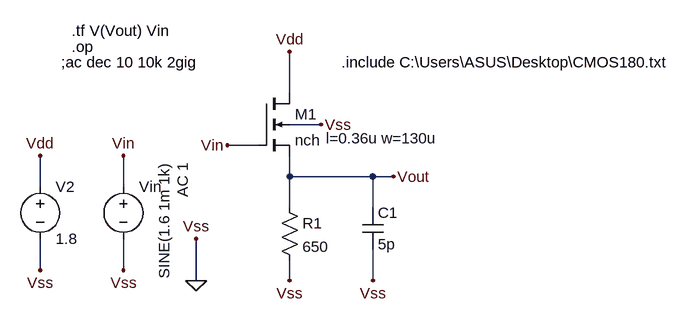
[diagram p0: schematic Common drain.asc]
Common drain.asc, the LTspice schematic file:
Version 4
SHEET 1 884 680
WIRE 304 64 304 0
WIRE 352 112 304 112
WIRE 256 144 208 144
WIRE 304 192 304 160
WIRE 432 192 304 192
WIRE 464 192 432 192
WIRE -80 208 -80 160
WIRE 48 208 48 160
WIRE 304 240 304 192
WIRE 432 240 432 192
WIRE -80 336 -80 288
WIRE 48 336 48 288
WIRE 160 352 160 288
WIRE 304 352 304 320
WIRE 432 352 432 304
FLAG 304 0 Vdd
FLAG 208 144 Vin
FLAG 464 192 Vout
FLAG 352 112 Vss
FLAG 304 352 Vss
FLAG 432 352 Vss
FLAG 48 336 Vss
FLAG -80 336 Vss
FLAG -80 160 Vdd
FLAG 48 160 Vin
FLAG 160 352 0
FLAG 160 288 Vss
DATAFLAG 304 192 ""
DATAFLAG 304 192 ""
DATAFLAG 304 192 ""
DATAFLAG 304 192 ""
SYMBOL nmos4 256 64 R0
WINDOW 123 104 69 Left 2
SYMATTR Value2 l=0.36u w=130u
SYMATTR InstName M1
SYMATTR Value nch
SYMBOL res 288 224 R0
SYMATTR InstName R1
SYMATTR Value 650
SYMBOL cap 416 240 R0
SYMATTR InstName C1
SYMATTR Value 5p
SYMBOL voltage 48 192 R0
WINDOW 3 63 -21 VRight 2
WINDOW 123 91 -21 VRight 2
WINDOW 39 0 0 Left 0
SYMATTR Value SINE(1.6 1m 1k)
SYMATTR Value2 AC 1
SYMATTR InstName Vin
SYMBOL voltage -80 192 R0
WINDOW 123 0 0 Left 0
WINDOW 39 0 0 Left 0
SYMATTR InstName V2
SYMATTR Value 1.8
TEXT 384 16 Left 2 !.include C:\\Users\\ASUS\\Desktop\\CMOS180.txt
TEXT -32 -32 Left 2 !.tf V(Vout) Vin
TEXT -32 -8 Left 2 !.op
TEXT -48 16 Left 2 !;ac dec 10 10k 2gig

The netlist it stands for:
* Common drain.asc
M1 Vdd Vin Vout 0 nch l=0.36u w=130u
R1 Vout 0 650
C1 Vout 0 5p
Vin Vin 0 SINE(1.6 1m 1k) AC 1
V2 Vdd 0 1.8
.model NMOS NMOS
.model PMOS PMOS
.lib standard.mos
.include C:\Users\ASUS\Desktop\CMOS180.txt
.tf V(Vout) Vin
.op
;ac dec 10 10k 2gig
.backanno
.end